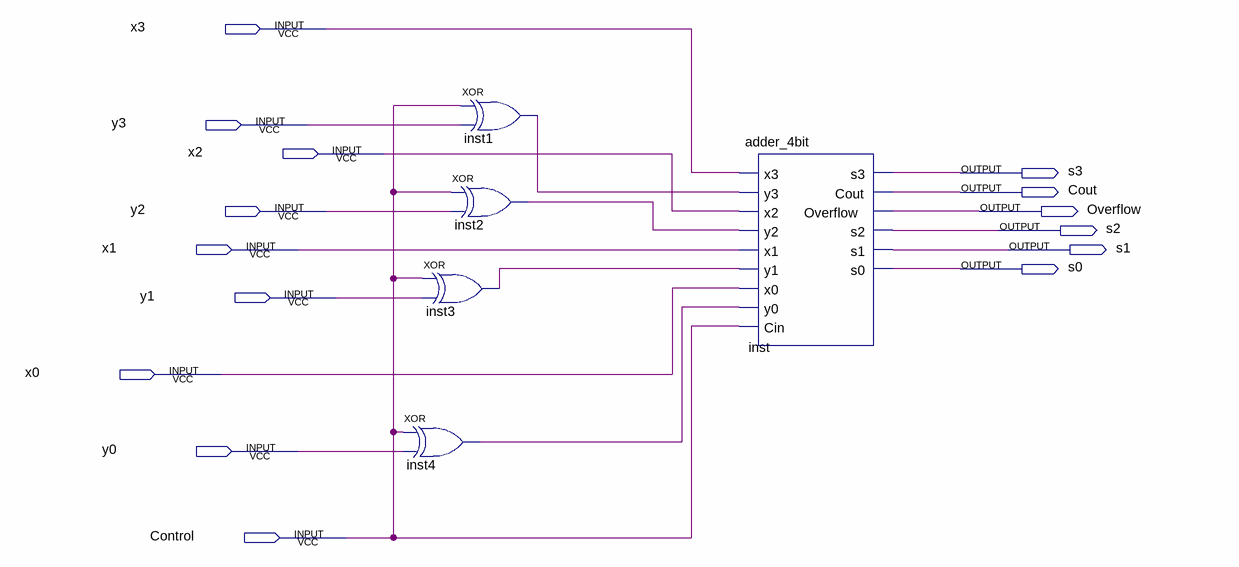
[diagram p0: schematic sheet]
// Quartus schematic lab07.bdf as structural Verilog: 5 symbols, 15 pins
module lab07 (
  input  x3,
  input  y3,
  input  x2,
  input  y2,
  input  x1,
  input  y1,
  input  x0,
  input  y0,
  input  Control,
  output s3,
  output Cout,
  output Overflow,
  output s2,
  output s1,
  output s0
);

  wire inst1_out, inst2_out, inst3_out, inst4_out;

  xor inst1 (inst1_out, Control, y3);
  xor inst2 (inst2_out, Control, y2);
  xor inst3 (inst3_out, Control, y1);
  xor inst4 (inst4_out, Control, y0);
  adder_4bit inst (
    .x3(x3), .y3(inst1_out), .x2(x2), .y2(inst2_out), .x1(x1), .y1(inst3_out), .x0(x0), .y0(inst4_out),
    .Cin(Control), .s3(s3), .Cout(Cout), .Overflow(Overflow), .s2(s2), .s1(s1), .s0(s0));
endmodule
